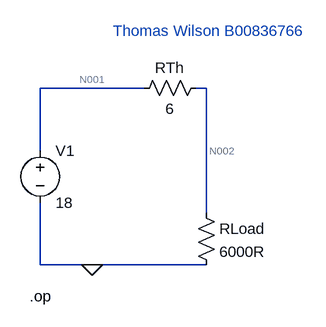
[diagram p0: schematic lab 4 circuit 4.asc]
lab 4 circuit 4.asc, the LTspice schematic file:
Version 4
SHEET 1 880 680
WIRE 160 0 0 0
WIRE 256 0 240 0
WIRE 0 96 0 0
WIRE 256 192 256 0
WIRE 0 272 0 176
WIRE 80 272 0 272
WIRE 256 272 80 272
FLAG 80 272 0
SYMBOL voltage 0 80 R0
WINDOW 123 0 0 Left 0
WINDOW 39 0 0 Left 0
SYMATTR InstName V1
SYMATTR Value 18
SYMBOL res 240 176 R0
SYMATTR InstName RLoad
SYMATTR Value 6000R
SYMBOL res 256 -16 R90
WINDOW 0 0 56 VBottom 2
WINDOW 3 32 56 VTop 2
SYMATTR InstName RTh
SYMATTR Value 6
TEXT -16 320 Left 2 !.op
TEXT 112 -88 Left 2 ;Thomas Wilson B00836766

The netlist it stands for:
* lab 4 circuit 4.asc
V1 N001 0 18
RLoad N002 0 6000R
RTh N002 N001 6
.op
* Thomas Wilson B00836766
.backanno
.end

* Results of the author's LTspice run, read from the files saved beside the schematic
* Operating Point:
*   V(n001) = 18 V
*   V(n002) = 17.98 V
*   I(Rth) = -2.997 mA
*   I(Rload) = 2.997 mA
*   I(V1) = -2.997 mA